# Altium schematic sheet LDO_LP2992IM5_3V3.SchDoc
size A4
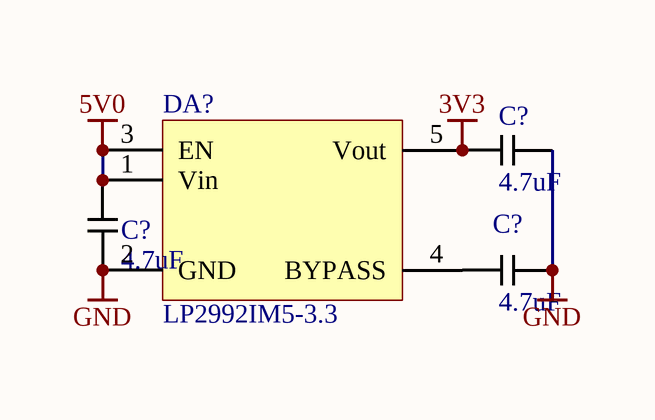
[diagram p0: LDO_LP2992IM5_3V3.SchDoc]

## Parts
(Parts that share a designator on the sheet are numbered #1, #2 ... from top to bottom, then left to right.)
C?#1  4.7uF  [C0603]
C?#2  4.7uF  [C0603]
C?#3  4.7uF  [C0603]
DA?  LP2992IM5-3.3  [SOT-23-5]

## Nets
3V3: C?#1.2 DA?.5(Vout)
5V0: C?#2.1 DA?.1(Vin) DA?.3(EN)
GND: C?#1.1 C?#2.2 C?#3.1 DA?.2(GND)
NetC?#3_2: C?#3.2 DA?.4(BYPASS)

## Library data of the parts
C?#1-C?#3 = C: Capacitor
DA? = LP2992IM5: TI LDO